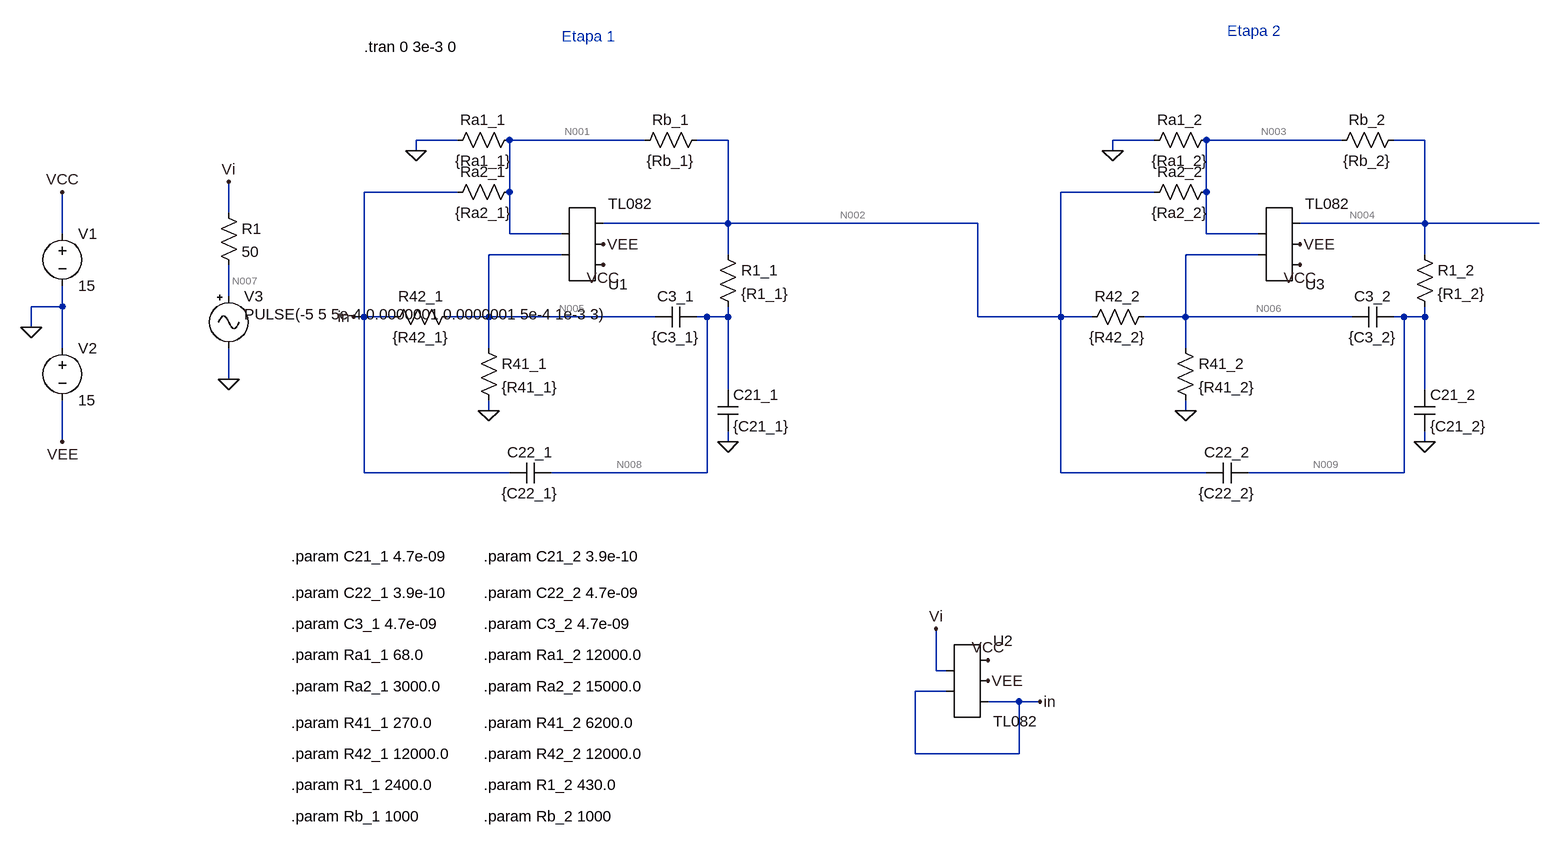
[diagram p0: schematic Valores Redondeados.asc]
* Valores Redondeados.asc
Ra1_1 N001 0 {Ra1_1}
Ra2_1 N001 in {Ra2_1}
R41_1 N005 0 {R41_1}
R42_1 N005 in {R42_1}
C3_1 N008 N005 {C3_1}
C22_1 N008 in {C22_1}
R1_1 N002 N008 {R1_1}
C21_1 N008 0 {C21_1}
Rb_1 N002 N001 {Rb_1}
V1 VCC 0 15
V2 0 VEE 15
Ra1_2 N003 0 {Ra1_2}
Ra2_2 N003 N002 {Ra2_2}
R41_2 N006 0 {R41_2}
R42_2 N006 N002 {R42_2}
C3_2 N009 N006 {C3_2}
C22_2 N009 N002 {C22_2}
R1_2 N004 N009 {R1_2}
C21_2 N009 0 {C21_2}
Rb_2 N004 N003 {Rb_2}
V3 N007 0 PULSE(-5 5 5e-4 0.0000001 0.0000001 5e-4 1e-3 3)
* U2: TL082 (symbol AutoGenerated\TL082 not available, pins judged from their places): pin1=Vi pin2=in pin3=VCC pin4=VEE pin5=in
R1 Vi N007 50
* U1: TL082 (symbol AutoGenerated\TL082 not available, pins judged from their places): pin1=N005 pin2=N001 pin3=VCC pin4=VEE pin5=N002
* U3: TL082 (symbol AutoGenerated\TL082 not available, pins judged from their places): pin1=N006 pin2=N003 pin3=VCC pin4=VEE pin5=N004
* Etapa 1
* Etapa 2
.param C21_1 4.7e-09
.param C22_1 3.9e-10
.param C3_1 4.7e-09
.param Ra1_1 68.0
.param Ra2_1 3000.0
.param R41_1 270.0
.param R42_1 12000.0
.param R1_1 2400.0
.param Rb_1 1000
.param C21_2 3.9e-10
.param C22_2 4.7e-09
.param C3_2 4.7e-09
.param Ra1_2 12000.0
.param Ra2_2 15000.0
.param R41_2 6200.0
.param R42_2 12000.0
.param R1_2 430.0
.param Rb_2 1000
.tran 0 3e-3 0
.backanno
.end

* Results of the author's LTspice run, read from the files saved beside the schematic
* Operating Point, zero values left out:
*   V(n001) = -110 mV
*   V(in) = -5 V
*   V(n005) = -110 mV
*   V(n008) = -97.8 mV
*   V(n002) = -97.8 mV
*   V(vcc) = 15 V
*   V(vee) = -15 V
*   V(n003) = -33.31 mV
*   V(n006) = -33.32 mV
*   V(n009) = -31.78 mV
*   V(n004) = -31.78 mV
*   V(n007) = -5 V
*   V(vi) = -5 V
*   I(R1) = -40.04 pA
*   I(Rb_2) = 1.524 µA
*   I(R42_2) = 5.374 µA
*   I(R41_2) = -5.374 µA
*   I(Ra2_2) = 4.3 µA
*   I(Ra1_2) = -2.776 µA
*   I(Rb_1) = 12.2 µA
*   I(R42_1) = 407.5 µA
*   I(R41_1) = -407.5 µA
*   I(Ra2_1) = 1.63 mA
*   I(Ra1_1) = -1.618 mA
*   I(V3) = -40.04 pA
*   I(V2) = -42.59 mA
*   I(V1) = -42.58 mA
*   Ix(u2:1) = 40.04 pA
*   Ix(u2:2) = 40.04 pA
*   Ix(u2:3) = 14.19 mA
*   Ix(u2:4) = -14.2 mA
*   Ix(u2:5) = 2.037 mA
*   Ix(u1:1) = 44.94 pA
*   Ix(u1:2) = 44.94 pA
*   Ix(u1:3) = 14.19 mA
*   Ix(u1:4) = -14.19 mA
*   Ix(u1:5) = -2.528 µA
*   Ix(u3:1) = 45.02 pA
*   Ix(u3:2) = 45.02 pA
*   Ix(u3:3) = 14.19 mA
*   Ix(u3:4) = -14.19 mA
*   Ix(u3:5) = -1.524 µA
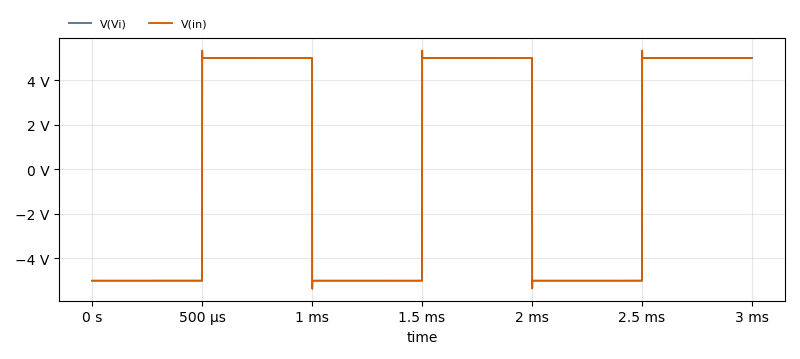
[diagram p1: Transient Analysis of Valores Redondeados.asc, plotted from the saved traces]
* Transient Analysis, 1 run:
*   V(Vi): min -5 V, max 5 V, average 498.9 µV, rms 5 V, last 5 V
*   V(in): min -5.365 V, max 5.347 V, average -936.4 µV, rms 4.998 V, last 5 V